# EAGLE design PangandaranV4 (EAGLE 9.1.1)
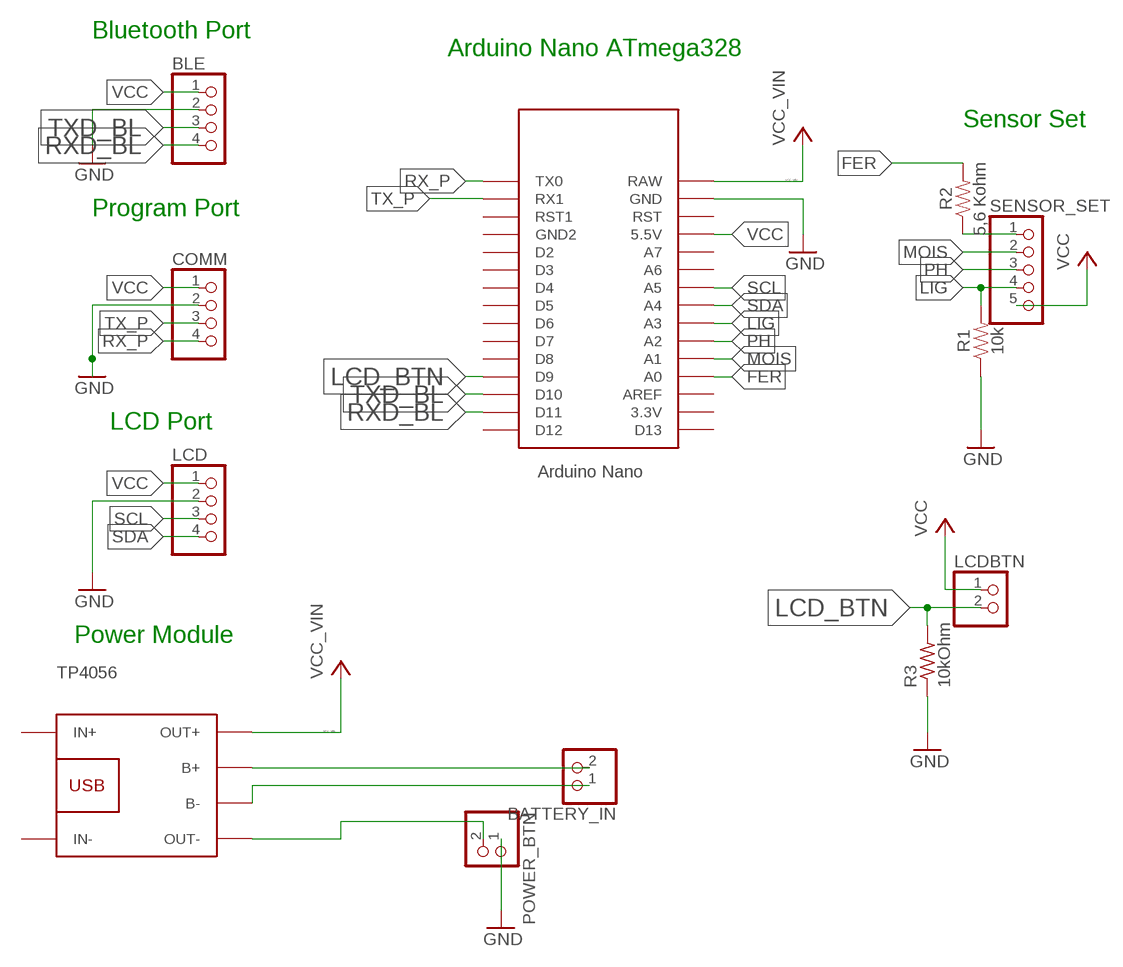
[diagram p0: schematic, sheet 1]

## Parts
BATTERY_IN  PINHD-1X2  [1X02]
BLE  PINHD-1X4  [1X04]
COMM  PINHD-1X4  [1X04]
LCD  PINHD-1X4  [1X04]
LCDBTN  PINHD-1X2  [1X02]
POWER_BTN  PINHD-1X2  [1X02]
R1  10k  1KOHM-0603-1/10W-1%  [0603]
R2  5,6 Kohm  0OHM-0603-1/10W-5%  [0603]
R3  10kOhm  R-US_M1206  [M1206]
SENSOR_SET  PINHD-1X5  [1X05]
TP4056  BATTERY-CHARGER-LI-PROT  [BATTERY-CHARGER-LI-PROT]
U$2  NANO  [NANO]

## Nets
FER: R2.2 U$2.A0
GND: BLE.2 COMM.2 LCD.2 POWER_BTN.1 R1.1 R3.1 U$2.GND
LCD_BTN: LCDBTN.2 R3.2 U$2.D9
LIG: R1.2 SENSOR_SET.4 U$2.A3
MOIS: SENSOR_SET.2 U$2.A1
N$1: R2.1 SENSOR_SET.1
N$2: BATTERY_IN.2 TP4056.B+
N$3: BATTERY_IN.1 TP4056.B-
N$4: POWER_BTN.2 TP4056.OUT-
PH: SENSOR_SET.3 U$2.A2
RX_P: COMM.4 U$2.TX0
RXD_BL: BLE.4 U$2.D11
SCL: LCD.3 U$2.A5
SDA: LCD.4 U$2.A4
TX_P: COMM.3 U$2.RX1
TXD_BL: BLE.3 U$2.D10
VCC: BLE.1 COMM.1 LCD.1 LCDBTN.1 SENSOR_SET.5 U$2.5V(5.5V)
VCC_VIN: TP4056.OUT+ U$2.RAW
Unconnected: TP4056.IN+ TP4056.IN- U$2.3.3V U$2.A6 U$2.A7 U$2.AREF U$2.D2 U$2.D3 U$2.D4 U$2.D5 U$2.D6 U$2.D7 U$2.D8 U$2.D12 U$2.D13 U$2.GND1(GND2) U$2.ICSP1 U$2.ICSP2 U$2.ICSP3 U$2.ICSP4 U$2.ICSP5 U$2.ICSP6 U$2.RST U$2.RST1

## Notes on the sheet
- Bluetooth Port
- Arduino Nano ATmega328
- Sensor Set
- Program Port
- LCD Port
- Power Module

## Library data of the parts
BATTERY_IN LCDBTN POWER_BTN = pinhead:PINHD-1X2: PIN HEADER
BLE COMM LCD = pinhead:PINHD-1X4: PIN HEADER
R1 = SparkFun-Resistors:1KOHM: 1kΩ resistor A resistor is a passive two-terminal electrical component that implements electrical resistance as a circuit element. Resistors act to reduce current flow, and, at the same time, act to lower voltage levels within circuits. - Wikipedia; PROD_ID: RES-07856; VALUE: 1k
R2 = SparkFun-Resistors:0OHM: 0Ω resistor A resistor is a passive two-terminal electrical component that implements electrical resistance as a circuit element. Resistors act to reduce current flow, and, at the same time, act to lower voltage levels within circuits. - Wikipedia; PROD_ID: RES-08609; VALUE: 0
R3 = rcl:R-US_: RESISTOR, American symbol; SPICEPREFIX: R
SENSOR_SET = pinhead:PINHD-1X5: PIN HEADER
TP4056 = diy-modules:BATTERY-CHARGER-LI-PROT: Lithium Battery 5V Charger with protection circuit More details available here: http://www.instructables.com/id/DIY-Lithium-ion-Battery-Charger/step4/TP4056-based-lithium-ion-battery-charger-module/ Click here to find device on ebay.com <http://www.ebay.com/sch/tp4056+charger+usb+protection>
U$2 = Arduino-clone:NANO: Arduino Nano

## Board
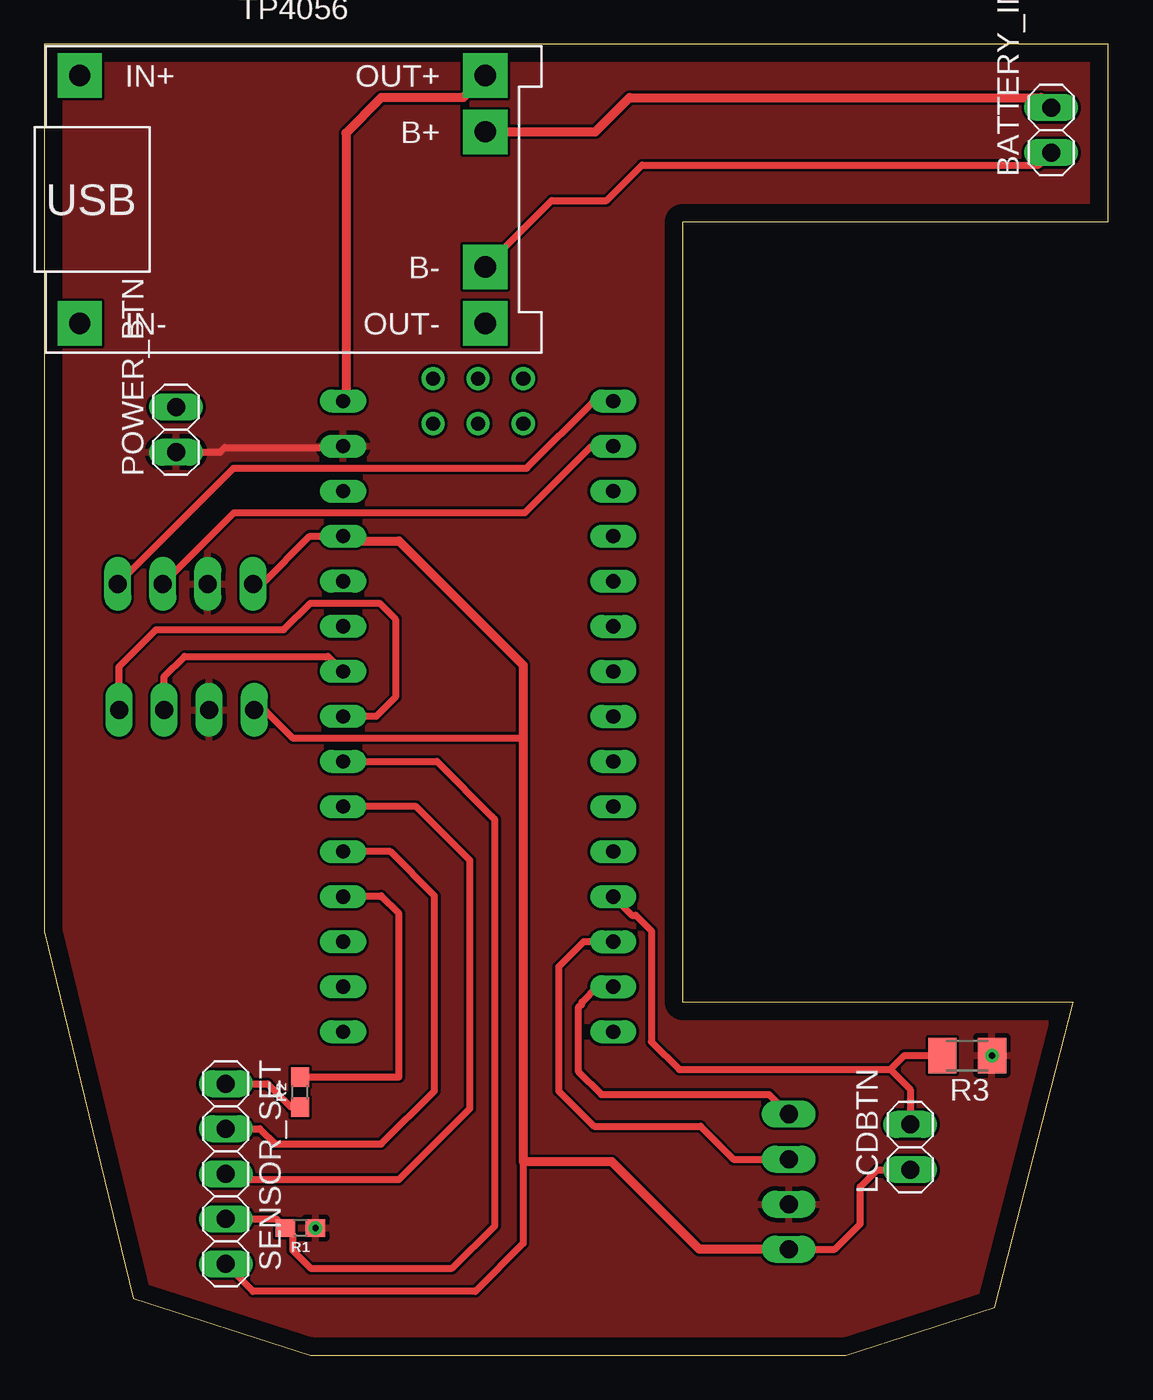
[diagram p1: board, top side]
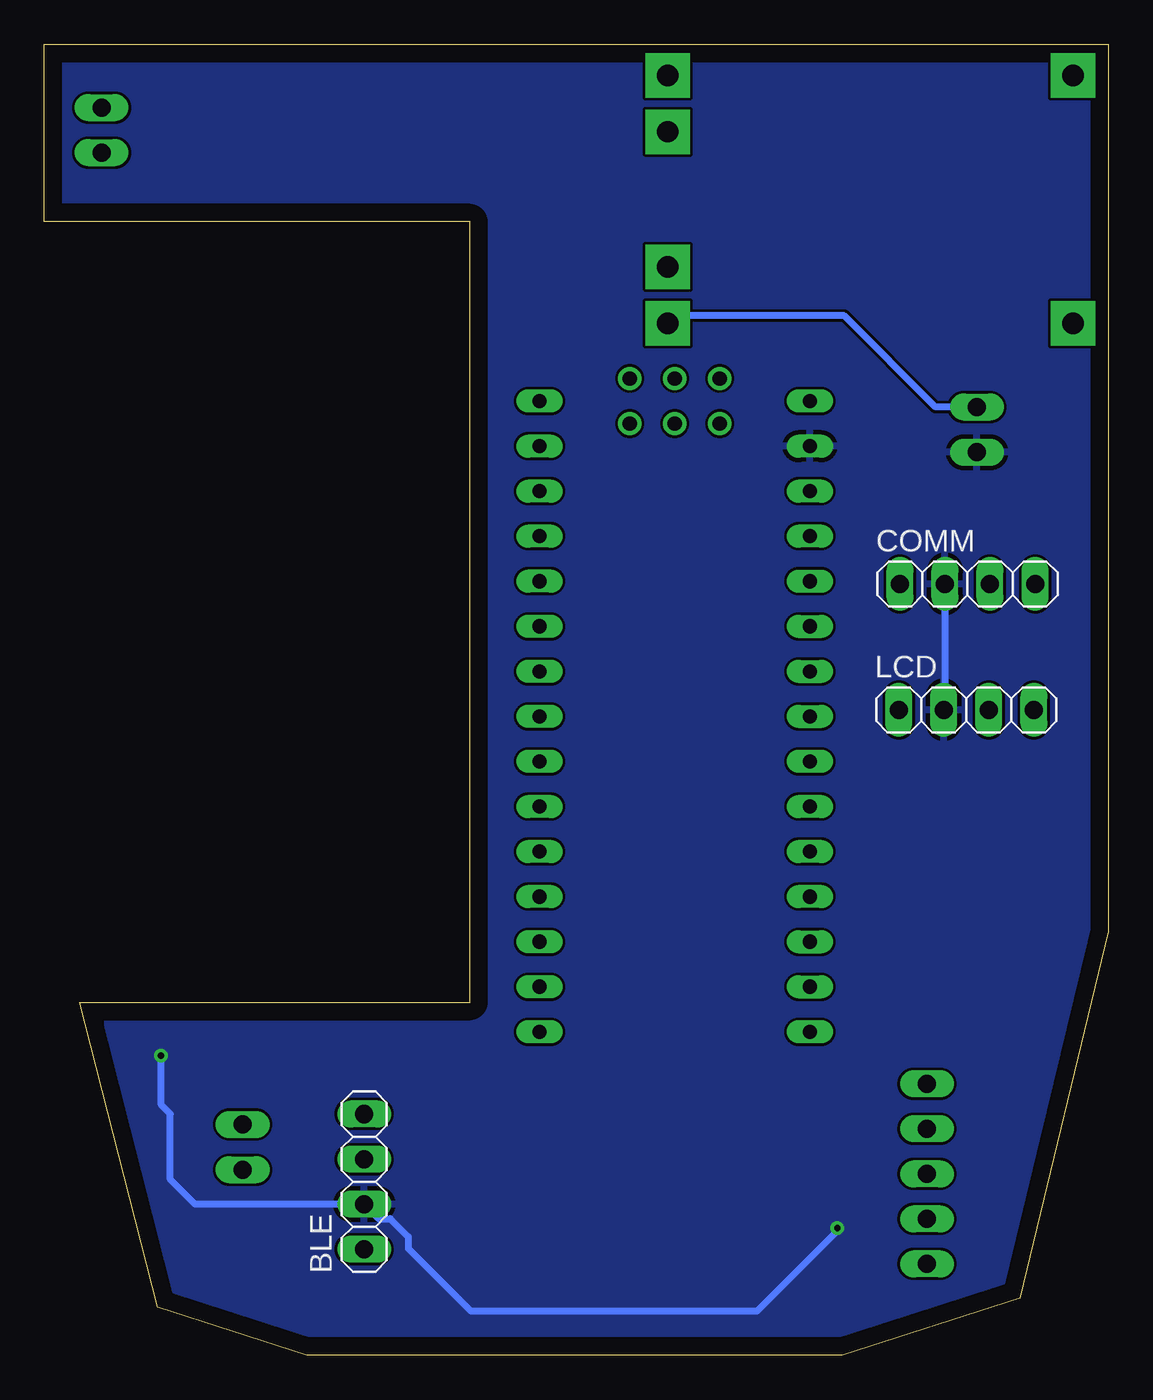
[diagram p2: board, bottom side, seen from below]

Size 60 x 73.9 mm. Coordinates in mm from the lower left corner, seen from the top.
Outline: 15,0 45.2,0 53.6,2.7 58,19.9 36,19.9 36,63.9 60,63.9 60,73.9 0,73.9 0,23.9 5,3.2 15,0
Copper layers (1*16): Top 0.035mm / dielectric 1.5mm / Bottom 0.035mm
Design rules "default *": minimum track width 6mil, minimum drill 0.35mm, track to track 6mil, track to pad 6mil, pad to pad 6mil, via to via 6mil, smd to smd 6mil, copper to edge 40mil, drill to drill 6mil, minimum pad ring 10mil, minimum via ring 8mil, stop-mask expansion 4mil, vias tented up to drill 0mil, thermal gap 10mil

### Footprints (pad centres in the part's own frame; a part is rotated, then mirrored left to right if it is on the bottom)
1X02 = drill 1.016 long: 1 -1.27,0; 2 1.27,0
1X04 = drill 1.016 long: 1 -3.81,0; 2 -1.27,0; 3 1.27,0; 4 3.81,0
0603 = smd 1.1 x 1: 1 -0.85,0; 2 0.85,0
M1206 = smd 1.6 x 2: 1 -1.4,0; 2 1.4,0
1X05 = drill 1.016 long: 1 -5.08,0; 2 -2.54,0; 3 0,0; 4 2.54,0; 5 5.08,0
BATTERY-CHARGER-LI-PROT = drill 1.2 pad 2.5 square: B+ 10.795,3.81; B- 10.795,-3.81; IN+ -12.065,6.985; IN- -12.065,-6.985; OUT+ 10.795,6.985; OUT- 10.795,-6.985
NANO = drill 0.8 long: 3.3V -10.16,24.13; 5V -10.16,-1.27; A0 -10.16,19.05; A1 -10.16,16.51; A2 -10.16,13.97; A3 -10.16,11.43; A4 -10.16,8.89; A5 -10.16,6.35; A6 -10.16,3.81; A7 -10.16,1.27; AREF -10.16,21.59; D2 5.08,1.27; D3 5.08,3.81; D4 5.08,6.35; D5 5.08,8.89; D6 5.08,11.43; D7 5.08,13.97; D8 5.08,16.51; D9 5.08,19.05; D10 5.08,21.59; D11 5.08,24.13; D12 5.08,26.67; D13 -10.16,26.67; GND -10.16,-6.35; GND1 5.08,-1.27; RAW -10.16,-8.89; RST -10.16,-3.81; RST1 5.08,-3.81; RX1 5.08,-6.35; TX0 5.08,-8.89 | drill 0.8: ICSP1 -5.08,-10.16; ICSP2 -5.08,-7.62; ICSP3 -2.54,-10.16; ICSP4 -2.54,-7.62; ICSP5 0,-10.16; ICSP6 0,-7.62

### Placement (x,y rotation side)
BATTERY_IN  56.77,69.07 90 top
BLE  41.97,9.78 90 bottom
COMM  7.95,43.48 0 bottom
LCD  8.02,36.38 0 bottom
LCDBTN  48.82,11.73 90 top
POWER_BTN  7.42,52.18 90 top
R1  14.44,7.17 180 top
R2  14.42,14.83 90 top
R3  52.03,16.89 180 top
SENSOR_SET  10.23,10.22 270 top
TP4056  14.06,65.16 0 top
U$2  27,44.9 180 bottom

### Tracks (layer width: path | path; a pad name or v marks a point on that pad's centre or on a via)
FER
  Top 0.406: U$2.A0 18.95,25.85 19,25.9 20,24.9 20,15.68 R2.2
GND  (via drill 0.35)
  Top 0.406: POWER_BTN.1 9.92,50.91 10.18,51.17 16.76,51.17 U$2.GND
  Bottom 0.406: COMM.2 9.22,36.45 LCD.2 | R3.1 53.4,16.86 53.4,14.1 52.9,13.6 52.9,9.9 51.51,8.51 BLE.2 41.16,7.7 40.49,7.7 39.48,6.68 39.48,6.02 35.96,2.5 19.8,2.5 15.2,7.1 15.27,7.17 R1.1
  other vias: 53.43,16.89 15.29,7.17
  pour Bottom: 0.1,73.8 60.1,73.8 60.1,63.7 36,63.7 36,19.9 58,19.9 53.6,2.7 45.1,0 14.8,0 5,3.1 0,23.9
  pour Top: 0.1,73.7 60.1,73.7 60.1,63.8 36,63.8 36,19.9 57.9,19.9 53.6,2.7 45.2,0 14.9,-0.1 4.9,3.3 0,23.6
LCD_BTN
  Top 0.406: U$2.D9 33.13,24.8 33.35,24.8 34.23,23.93 34.23,17.67 35.8,16.1 47.7,16.1 | LCDBTN.2 48.82,14.98 47.7,16.1 | 47.7,16.1 48.49,16.89 R3.2
LIG
  Top 0.406: U$2.A3 22.13,33.47 25.25,30.35 | 25.25,30.35 25.4,30.2 | SENSOR_SET.4 13.08,7.68 R1.2 14,6.76 14,5.9 15,4.9 23,4.9 25.4,7.3 25.4,30.2 | 25.4,30.2 25.25,30.35
MOIS
  Top 0.406: U$2.A1 19.51,28.39 22,25.9 22,14.9 19,11.9 13,11.9 12.14,12.76 SENSOR_SET.2
N$1
  Top 0.406: 14.6,13.8 R2.1 13.92,13.98 12.6,15.3 SENSOR_SET.1
N$2
  Top 0.508: TP4056.B+ 31.07,68.97 33,70.9 56.21,70.9 BATTERY_IN.2
N$3
  Top 0.406: TP4056.B- 28.61,65.1 31.7,65.1 33.7,67.1 56.07,67.1 BATTERY_IN.1
  Bottom 0.406: 24.8,61.4 TP4056.B-
N$4
  Bottom 0.406: POWER_BTN.2 9.75,53.45 14.9,58.6 24.43,58.6 TP4056.OUT-
PH
  Top 0.406: U$2.A2 20.97,30.93 24,27.9 24,13.9 20,9.9 10.55,9.9 SENSOR_SET.3
RX_P
  Top 0.406: COMM.4 10.66,50 27.2,50 30.99,53.79 U$2.TX0
RXD_BL
  Top 0.406: U$2.D11 31.17,20.77 30.3,19.9 30.3,19.8 30.1,19.6 30.1,16 31.4,14.7 40.86,14.7 BLE.4
SCL
  Top 0.406: LCD.3 6.75,38.25 7.9,39.4 15.99,39.4 U$2.A5
SDA
  Top 0.406: LCD.4 4.21,38.81 6.3,40.9 13.5,40.9 15,42.4 18.9,42.4 19.8,41.5 19.8,37.1 18.71,36.01 U$2.A4
TX_P
  Top 0.406: COMM.3 10.7,47.5 27.1,47.5 30.85,51.25 U$2.RX1
TXD_BL
  Top 0.406: U$2.D10 30.41,23.31 29,21.9 29,14.9 31,12.9 37,12.9 38.85,11.05 BLE.3
VCC
  Top 0.406: 27,34.8 14.01,34.8 12.43,36.38 LCD.1 | COMM.1 12.28,43.48 14.97,46.17 U$2.5V | 27,10.9 27,6.3 24.3,3.6 11.77,3.6 SENSOR_SET.5 | BLE.1 44.57,5.97 46,7.4 46,9.5 46.96,10.46 LCDBTN.1
  Top 0.508: U$2.5V 17.11,45.9 20,45.9 27,38.9 27,34.8 27,10.9 32,10.9 36.93,5.97 BLE.1
VCC_VIN
  Top 0.508: TP4056.OUT+ 23.61,70.9 19,70.9 17,68.9 17,53.95 U$2.RAW